# Altium schematic sheet Probe-Scope RAM v1.0.SchDoc: Probe-Scope: RAM
size Letter; CompanyName: Probe-Scope; Organization: Probe-Scope; Address1: Probe-Scope: Unified USB; Address2: Oscilloscope Probe; Address3: ©2019 M. Omo, J. Rowley,; Address4: K. Hall, released under the; SheetNumber: 5; PageSetup: Record=PageOptions|CenterHorizontal=True|CenterVertical=True|PrintScale=0.96|XCorrection=1.00|YCorrection=1.00|PrintKind=1|BorderSize=5000000|LeftOffset=0|BottomOffset=0|Orientation=2|PaperLength=1000|PaperWidth=1000|Scale=100|PaperSource=7|PrintQuality=-4|MediaType=1|DitherType=10|PaperKind=11x17|PrintScaleMode=1; License: CERN OHL v1.2
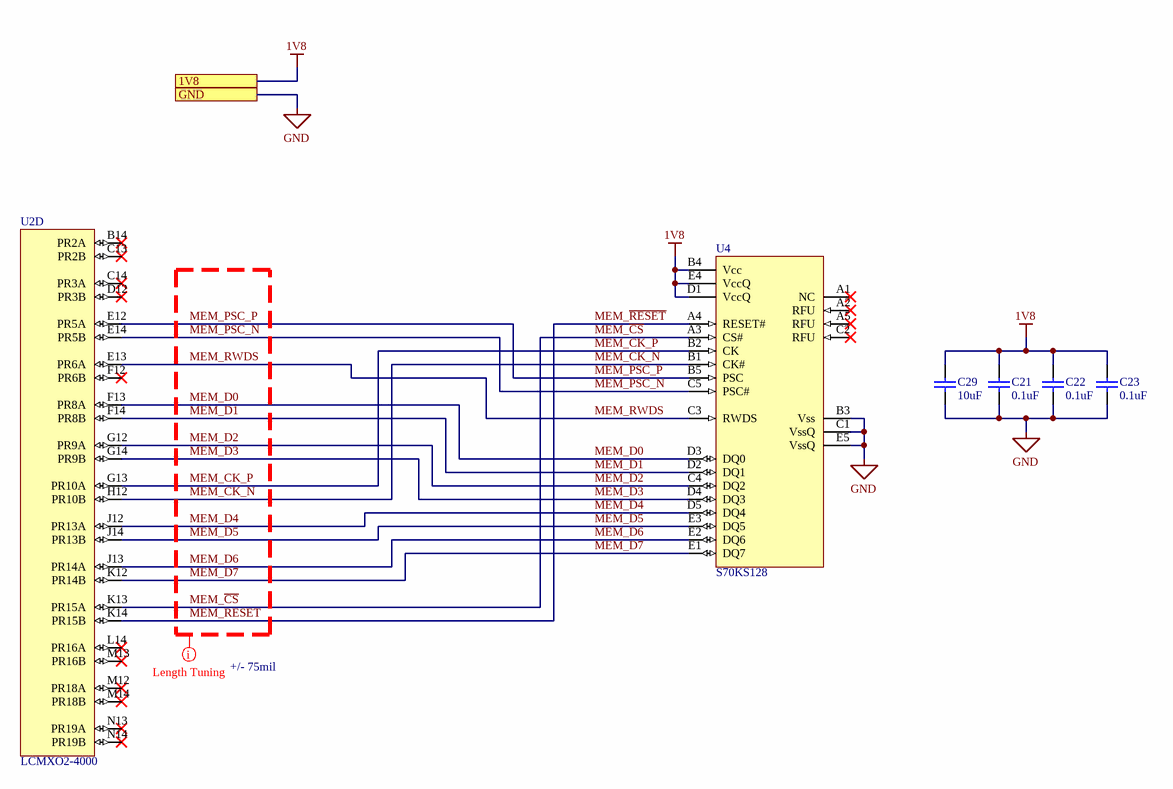
[diagram p0: Probe-Scope RAM v1.0.SchDoc]

## Parts
C21  value 0.1uF  [0402(1005)]  (hidden comment: 6.3V)
C22  value 0.1uF  [0402(1005)]  (hidden comment: 6.3V)
C23  value 0.1uF  [0402(1005)]  (hidden comment: 6.3V)
C29  value 10uF  [0603(1608)]  (hidden comment: 25V)
U2  LCMXO2-4000  [132_Ball_csBGA_MachXO2]  (part D of 5)
U4  S70KS128  [Cypress-VAA024]

## Ports
1V8, GND

## Nets
1V8: C21.2 C22.2 C23.2 C29.2 U4.B4(Vcc) U4.D1(VccQ) U4.E4(VccQ) ; port 1V8
GND: C21.1 C22.1 C23.1 C29.1 U4.B3(Vss) U4.C1(VssQ) U4.E5(VssQ) ; port GND
MEM_~{CS}: U2.K13(PR15A) U4.A3(CS#)
MEM_CK_N: U2.H12(PR10B) U4.B1(CK#)
MEM_CK_P: U2.G13(PR10A) U4.B2(CK)
MEM_D0: U2.F13(PR8A) U4.D3(DQ0)
MEM_D1: U2.F14(PR8B) U4.D2(DQ1)
MEM_D2: U2.G12(PR9A) U4.C4(DQ2)
MEM_D3: U2.G14(PR9B) U4.D4(DQ3)
MEM_D4: U2.J12(PR13A) U4.D5(DQ4)
MEM_D5: U2.J14(PR13B) U4.E3(DQ5)
MEM_D6: U2.J13(PR14A) U4.E2(DQ6)
MEM_D7: U2.K12(PR14B) U4.E1(DQ7)
MEM_PSC_N: U2.E14(PR5B) U4.C5(PSC#)
MEM_PSC_P: U2.E12(PR5A) U4.B5(PSC)
MEM_~{RESET}: U2.K14(PR15B) U4.A4(RESET#)
MEM_RWDS: U2.E13(PR6A) U4.C3(RWDS)

Not connected (* = marked no-connect by the designer): U2 B14(PR2A)* C13(PR2B)* C14(PR3A)* D12(PR3B)* F12(PR6B)* L14(PR16A)* M12(PR18A)* M13(PR16B)* M14(PR18B)* N13(PR19A)* N14(PR19B)*; U4 A1(NC)* A2(RFU)* A5(RFU)* C2(RFU)*

## Layout directives
net class MEMDDR - 150mil: MEM_CK_N, MEM_CK_P, MEM_D0, MEM_D1, MEM_D2, MEM_D3, MEM_D4, MEM_D5, MEM_D6, MEM_D7, MEM_PSC_N, MEM_PSC_P, MEM_RWDS, MEM_~{CS}, MEM_~{RESET}

## Notes on the sheet
- +/- 75mil
- Title:
- Asm:
- Date:
- Variant:
- Time:
- Number:
- Sheet
- of
- Rev:
- File:

## Library data of the parts
C21-C23 = 1875: Key: 1875; MENG_PN: ???1875; MANF: Samsung Electro-Mechanics; MANF_PN: CL05B104KQ5NNNC; VENDOR: Digikey; VENDOR_PN: 1276-1511-1-ND; P&V Description: Capacitor, Ceramic, 0.1uF, 6.3V, 10% Tol, 125C, X7R, 0402, SMD; Class: Capacitor; Type: Ceramic; Other: X7R; Tolerance: 10; Voltage: 6.3; Max Temperature: 125; Approved: False; Package: 0402; SMD: True; Date Modified: 11/6/2018 11:14:02 AM; Modified By: jrowley; Parent Key: 1875; Verified: False
C29 = 1306: Key: 1306; MENG_PN: ???1306; MANF: Samsung Electro-Mechanics; MANF_PN: CL10A106MA8NRNC; VENDOR: Digikey; VENDOR_PN: 1276-1869-1-ND; P&V Description: Capacitor, Ceramic, 10uF, 25V, 20% Tol, 85C, X5R, 0603, SMD; Class: Capacitor; Type: Ceramic; Other: X5R; Tolerance: 20; Voltage: 25; Max Temperature: 85; Approved: True; Package: 0603; SMD: True; Date Modified: 3/3/2015 11:08:29 AM; Modified By: sotterbacher; Parent Key: 1306; Verified: True
U2 = MachXO2-4000: MANF_PN: LCMXO2-4000HC-4MG132C; MANF: Lattice Semiconductor; VENDOR: DigiKey; VENDOR_PN: 220-1458-ND
U4 = S70KS: MANF: Cypress; MANF_PN: S70KS1281DPBHV020; VENDOR: DigiKey; VENDOR_PN: 2015-S70KS1281DPBHV020-ND